# Altium schematic sheet BLOCK_DIAGRAM.SchDoc
size A4; SheetNumber: 2; SheetTotal: 6
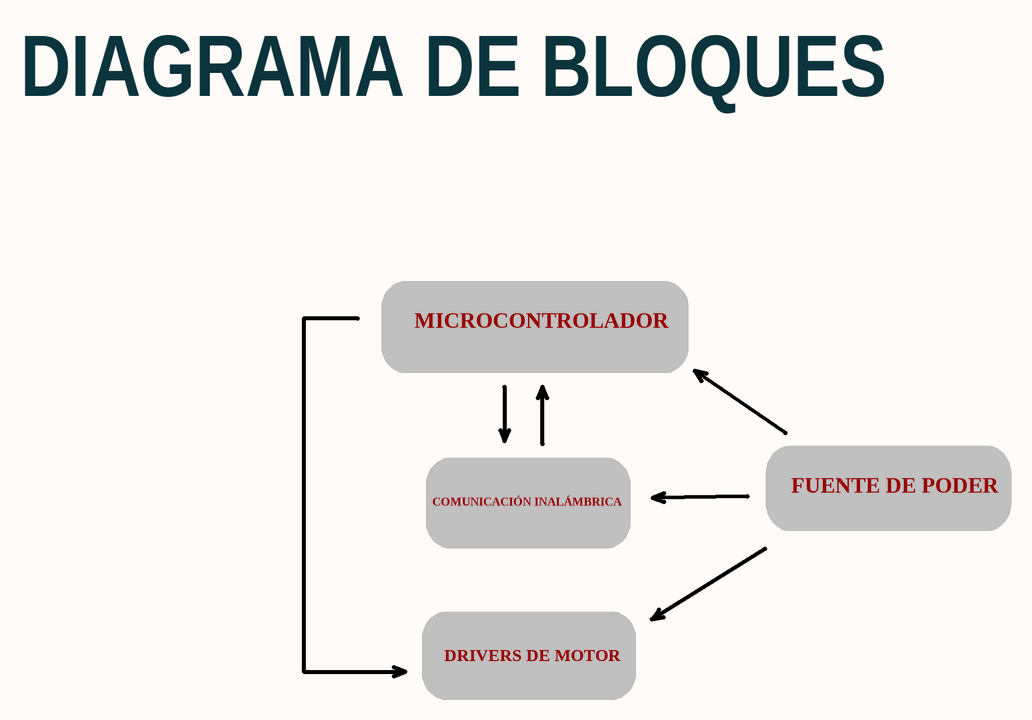
[diagram p0: BLOCK_DIAGRAM.SchDoc]

## Notes on the sheet
- DIAGRAMA DE BLOQUES
- MICROCONTROLADOR
- COMUNICACIÓN INALÁMBRICA
- FUENTE DE PODER
- DRIVERS DE MOTOR
- Documento:
- Autor:
- Carnet:
- Proyecto:
- Curso:
- Fecha:
- Revisión:
- Tamaño:
- Carta
- Hoja:
- de: